# EAGLE design mag_encoder_Rev2 (EAGLE 7.3.0)
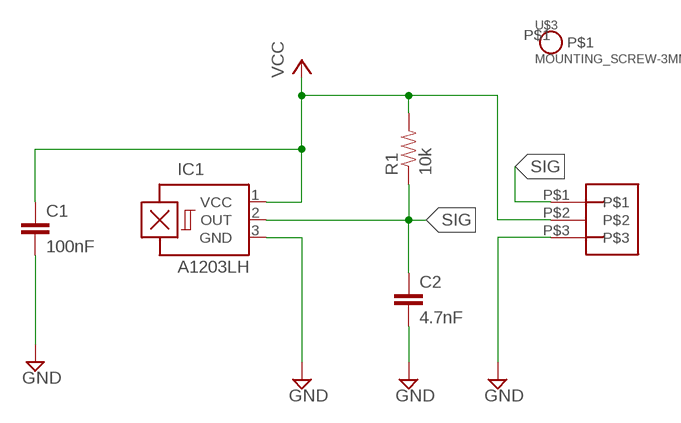
[diagram p0: schematic, sheet 1]

## Parts
C1  100nF  CAP0603-CAP  [0603-CAP]
C2  4.7nF  4.7NF-50V-10%(0603)  [0603-CAP]
IC1  A1203LH  [SOT23-W]
R1  10k  10.5KOHM1/10W1%(0603)  [0603]
U$1  3_PIN_JST-XH  [3_PIN_JST-XH]
U$3  MOUNTING_SCREW-3MM  [MOUNTING_SCREW-3MM]

## Nets
GND: C1.2 C2.2 IC1.3(GND) U$1.P$3
SIG: C2.1 IC1.2(OUT) R1.1 U$1.P$1
VCC: C1.1 IC1.1(VCC) R1.2 U$1.P$2
Unconnected: U$3.P$1

## Library data of the parts
C1 = SparkFun-Capacitors:CAP: Capacitor Standard 0603 ceramic capacitor, and 0.1" leaded capacitor.
C2 = SparkFun-Capacitors:4.7NF-50V-10%(0603): CAP-11378; PROD_ID: CAP-11378
IC1 = allegro:A12*?: Hall-effect bipolar switch Source: http://www.allegromicro.com/en/Products/Part_Numbers/1202/1202.pdf; MF: ALLEGRO MICROSYSTEMS, INC.; MPN: A1203LLHLT-T; OC_FARNELL: 1791384; OC_NEWARK: 31K6608
R1 = SparkFun-Resistors:10.5KOHM1/10W1%(0603): RES-09570; PROD_ID: RES-09570; VALUE: 10.5k
U$1 = Clayton:3_PIN_JST-XH: 3-pin JST XH Shrouded Header, top entry, 2.5 mm pitch
U$3 = Clayton:MOUNTING_SCREW-3MM

## Board
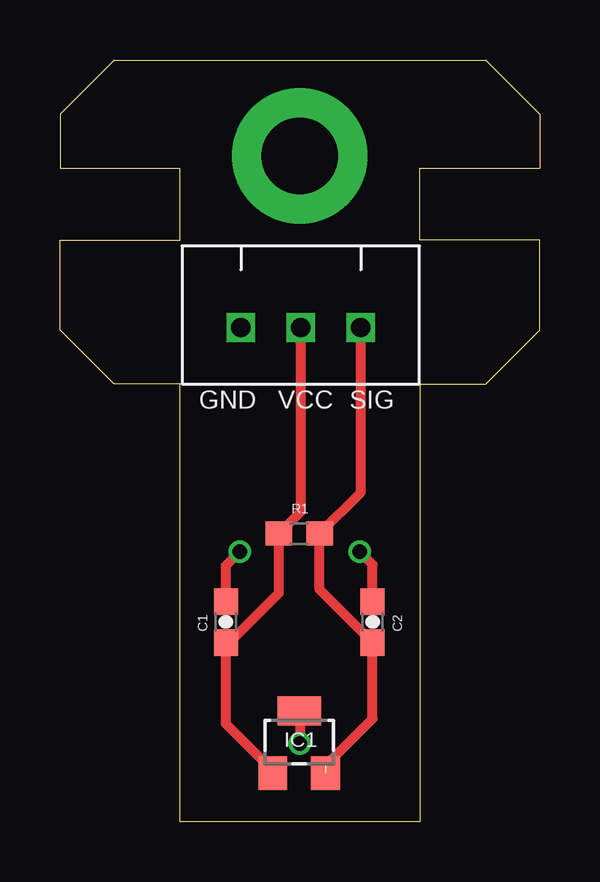
[diagram p1: board, top side]
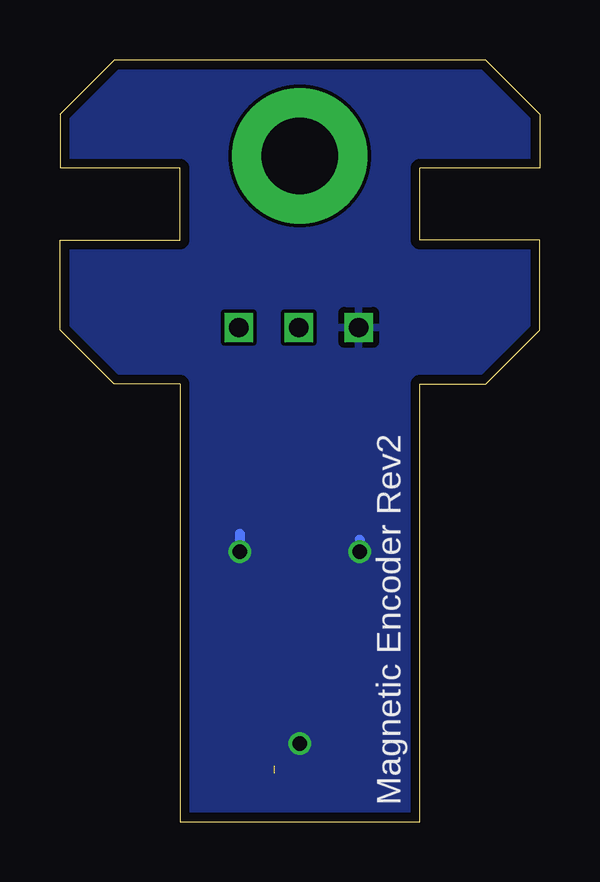
[diagram p2: board, bottom side, seen from below]

Size 20 x 31.75 mm. Coordinates in mm from the lower left corner, seen from the top.
Outline: 5,0 5,18.25 2.25,18.25 0,20.5 0,24.25 5,24.25 5,27.25 0,27.25 0,29.5 2.25,31.75 17.75,31.75 20,29.5 20,27.25 15,27.25 15,24.25 20,24.25 20,20.5 17.75,18.25 15,18.25 15,0 5,0
Copper layers (1*16): Top 0.0356mm / dielectric 1.5011mm / Bottom 0.0356mm
Design rules "LaenPCBOrder": minimum track width 6mil, minimum drill 13mil, track to track 6mil, track to pad 6mil, pad to pad 6mil, via to via 6mil, smd to smd 6mil, copper to edge 15mil, drill to drill 6mil, minimum pad ring 7mil, minimum via ring 7mil, stop-mask expansion 3mil, vias tented up to drill 0mil, thermal gap 10mil

### Footprints (pad centres in the part's own frame; a part is rotated, then mirrored left to right if it is on the bottom)
0603-CAP = smd 1.1 x 1: 1 -0.85,0; 2 0.85,0
SOT23-W = smd 1.2 x 1.4: 1 -1.1,-1.3; 2 1.1,-1.3 | smd 1.8 x 1.2: 3 0,1.3
0603 = smd 1.1 x 1: 1 -0.85,0; 2 0.85,0
3_PIN_JST-XH = drill 0.8 square: P$1 2.45,3.4; P$2 4.95,3.4; P$3 7.45,3.4
MOUNTING_SCREW-3MM = drill 3.2 pad 5.65: P$1 0,0

### Placement (x,y rotation side)
C1  6.92,8.31 90 top
C2  13.04,8.31 90 top
IC1  9.98,3.32 0 top
R1  9.98,12.01 180 top
U$1  14.99,24 180 top
U$3  10,27.75 0 top

### Tracks (layer width: path | path; a pad name or v marks a point on that pad's centre or on a via)
GND  (via drill 0.6)
  Top 0.406: IC1.3 10,4.59 v10,3.25 | C1.2 6.92,10.67 v7.5,11.25 | C2.2 13.04,10.71 v12.5,11.25
  Bottom 0.406: v10,3.25 10,3 | v7.5,11.25 7.5,11.75 | v12.5,11.25 12.5,12
  pour Bottom: -0.64,-4.51 27.75,-4.38 28.39,32.75 -0.64,32.63
SIG  (1 unrouted)
  Top 0.406: C2.1 13,7.43 | 11.08,2.33 13.04,4.29 C2.1 | C2.1 10.83,9.68 R1.1 12.54,13.72 U$1.P$1
VCC
  Top 0.152: 8.88,2.11 IC1.1 | 7.05,7.44 C1.1
  Top 0.406: 8.88,2.11 8.88,2.12 6.92,4.08 C1.1 | 7.05,7.44 9.13,9.52 R1.2 10.04,12.92 U$1.P$2

### Text on the board
tNames: GND | VCC | SIG
bNames: Magnetic Encoder Rev2